# EasyEDA Pro project ProPrj_ESP32-S3-Super Mini_2025-10-25.epro

# Schematic ESP32-S3-Super Mini
Board Name: PCB2; Create Date: 2025-10-25; Page Name: P1; Project Name: SSD1309; Schematic Name: ESP32-S3-Super Mini; Update Date: 2025-10-25; Company: EasyEDA.com; Drawn: EasyEDA; Page Size: A4; Part Number: JLCPCB-002; Reviewed: EasyEDA; Version: V0.1
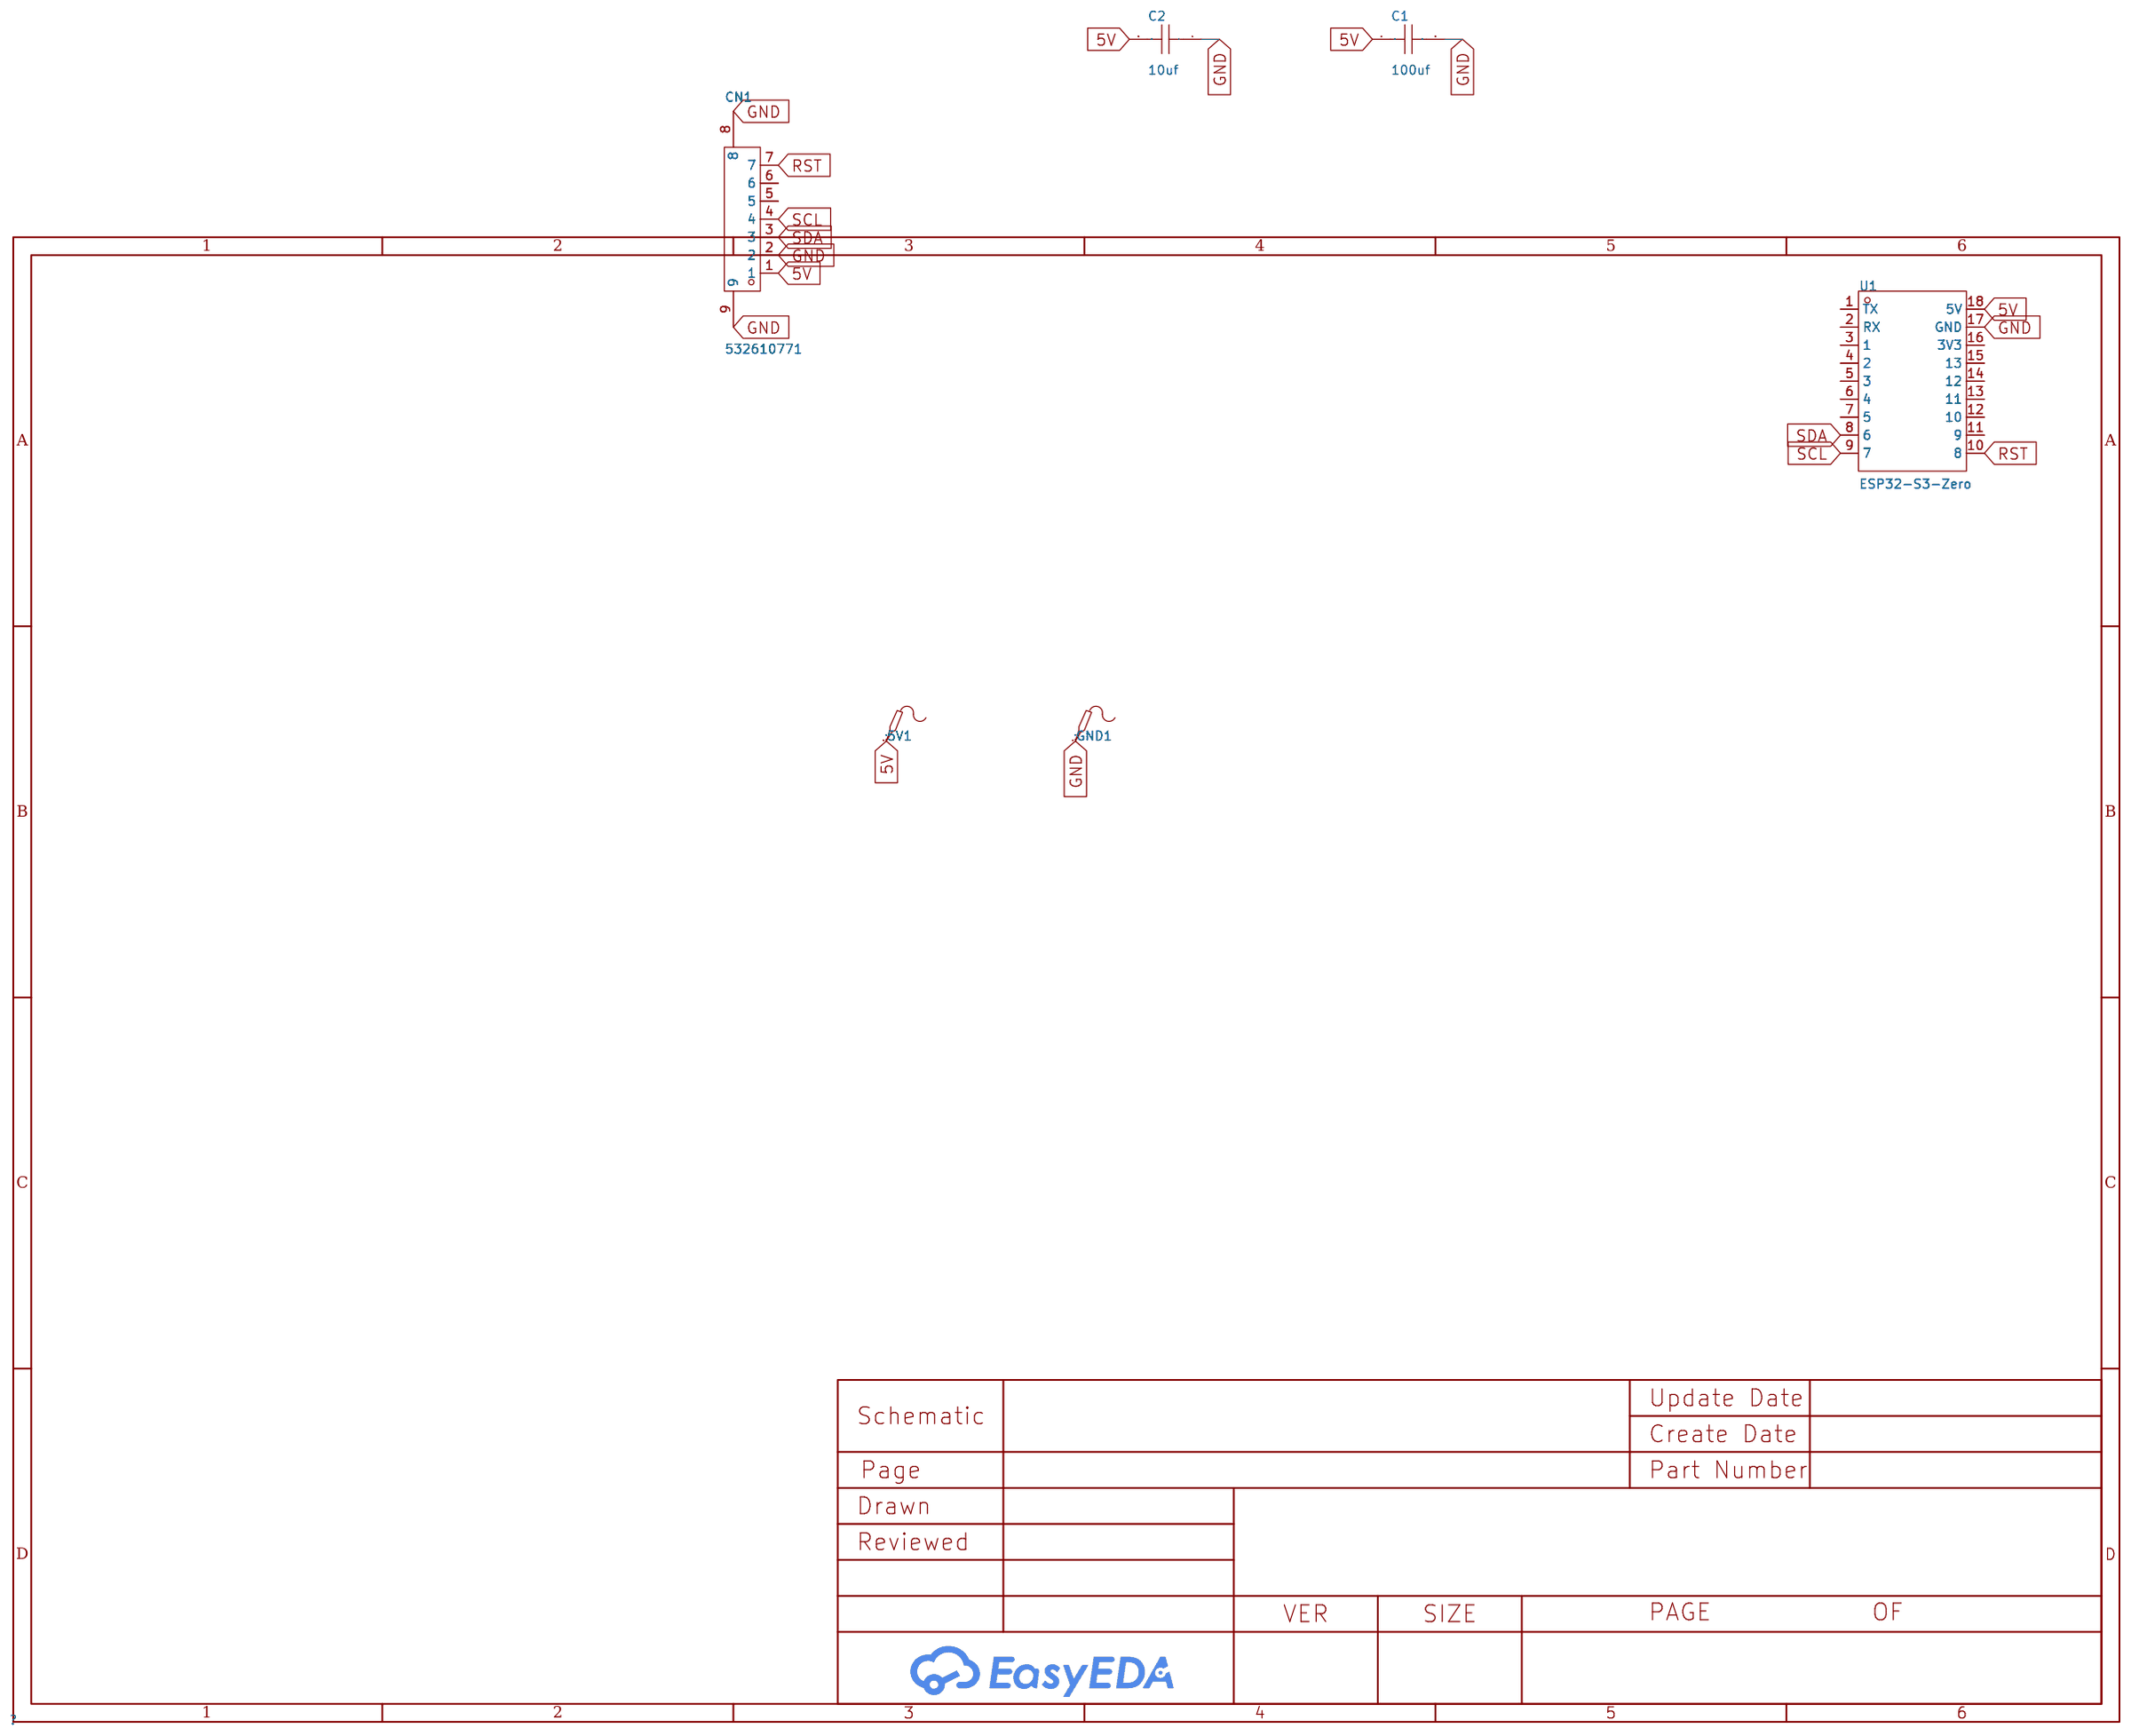
[diagram p0: schematic sheet]

## Parts
5V1  -  [Test-Point-0.5mm]
C1  100uf  [C1206]
C2  10uf  [C0603]
CN1  532610771  [CONN-SMD_532610771]
GND1  -  [Test-Point-0.5mm]
U1  ESP32-S3-Zero  [COMM-SMD_18P-P2.54-L23.5-W18.0-TL]

## Library data of the parts
5V1 GND1 = Test-Point: Test Point 测试点
C1 = C1206: Supplier Part: C9900018280; JLCPCB Part Class: Extended Part; Supplier: LCSC
C2 = CAP_0603: Supplier Footprint: 0603
CN1 = 532610771: Pins Structure:1x7P Pitch:1.25mm Mounting Type:Surface Mount, Right Angle Reference Series:PicoBlade(MX 1.25) Number of Pins:7P Number of Rows:1 Number of PINs Per Row:7 Row Spacing:- Current Rating:1A Contact Material:Phosphor Bronze Contact Plating:Tin; LCSC Part Name: 1x7P 间距:1.25mm 卧贴 系列:PicoBlade(MX 1.25); Supplier Part: C505276; Manufacturer: MOLEX; Supplier Footprint: SMD,P=1.25mm,卧贴; JLCPCB Part Class: Extended Part; Datasheet: https://www.molex.com/content/dam/molex/molex-dot-com/products/automated/en-us/salesdrawingpdf/532/53261/532610771_sd.pdf?inline; Supplier: LCSC; Pins Structure: 1x7P; Pitch: 1.25mm; Mounting Type: Surface Mount, Right Angle; Reference Series: PicoBlade(MX 1.25); Number of Pins: 7P; Number of Rows: 1; Number of PINs Per Row: 7; Current Rating: 1A; Contact Material: Phosphor Bronze; Contact Plating: Tin; Operating Temperature: -40℃~+105℃; Voltage Rating: 125V; Plastic Material: Glass-Fiber Reinforced PA; Flame Retardant Rating: UL94V-0; Supplementary Features: Auxiliary Solder Pin; Color: White; Z-Height of the Board: 3.4mm; X-Length of Bottom Edge on Board (Spacing Line): 13.9mm; Y-Width of Bottom Edge on Board: 5.2mm
U1 = ESP32-S3-Zero: Supplier Part: C9900152785; Supplier Footprint: SMD; Supplier: LCSC

## Nets
5V: 5V1.1 C1.1 C2.2 CN1.1 U1.18(5V)
GND: C1.2 C2.1 CN1.2 CN1.8 CN1.9 GND1.1 U1.17(GND)
RST: CN1.7 U1.10(8)
SCL: CN1.4 U1.9(7)
SDA: CN1.3 U1.8(6)

Not connected (* = marked no-connect by the designer): CN1 5 6; U1 1(TX) 2(RX) 3(1) 4(2) 5(3) 6(4) 7(5) 11(9) 12(10) 13(11) 14(12) 15(13) 16(3V3)

# Schematic ESP32-S3-Zero
Board Name: Board1; Create Date: 2025-10-25; Page Name: P1; Project Name: SSD1309; Schematic Name: Schematic1; Update Date: 2025-10-25; Company: EasyEDA.com; Drawn: EasyEDA; Page Size: A4; Part Number: JLCPCB-002; Reviewed: EasyEDA; Version: V0.1
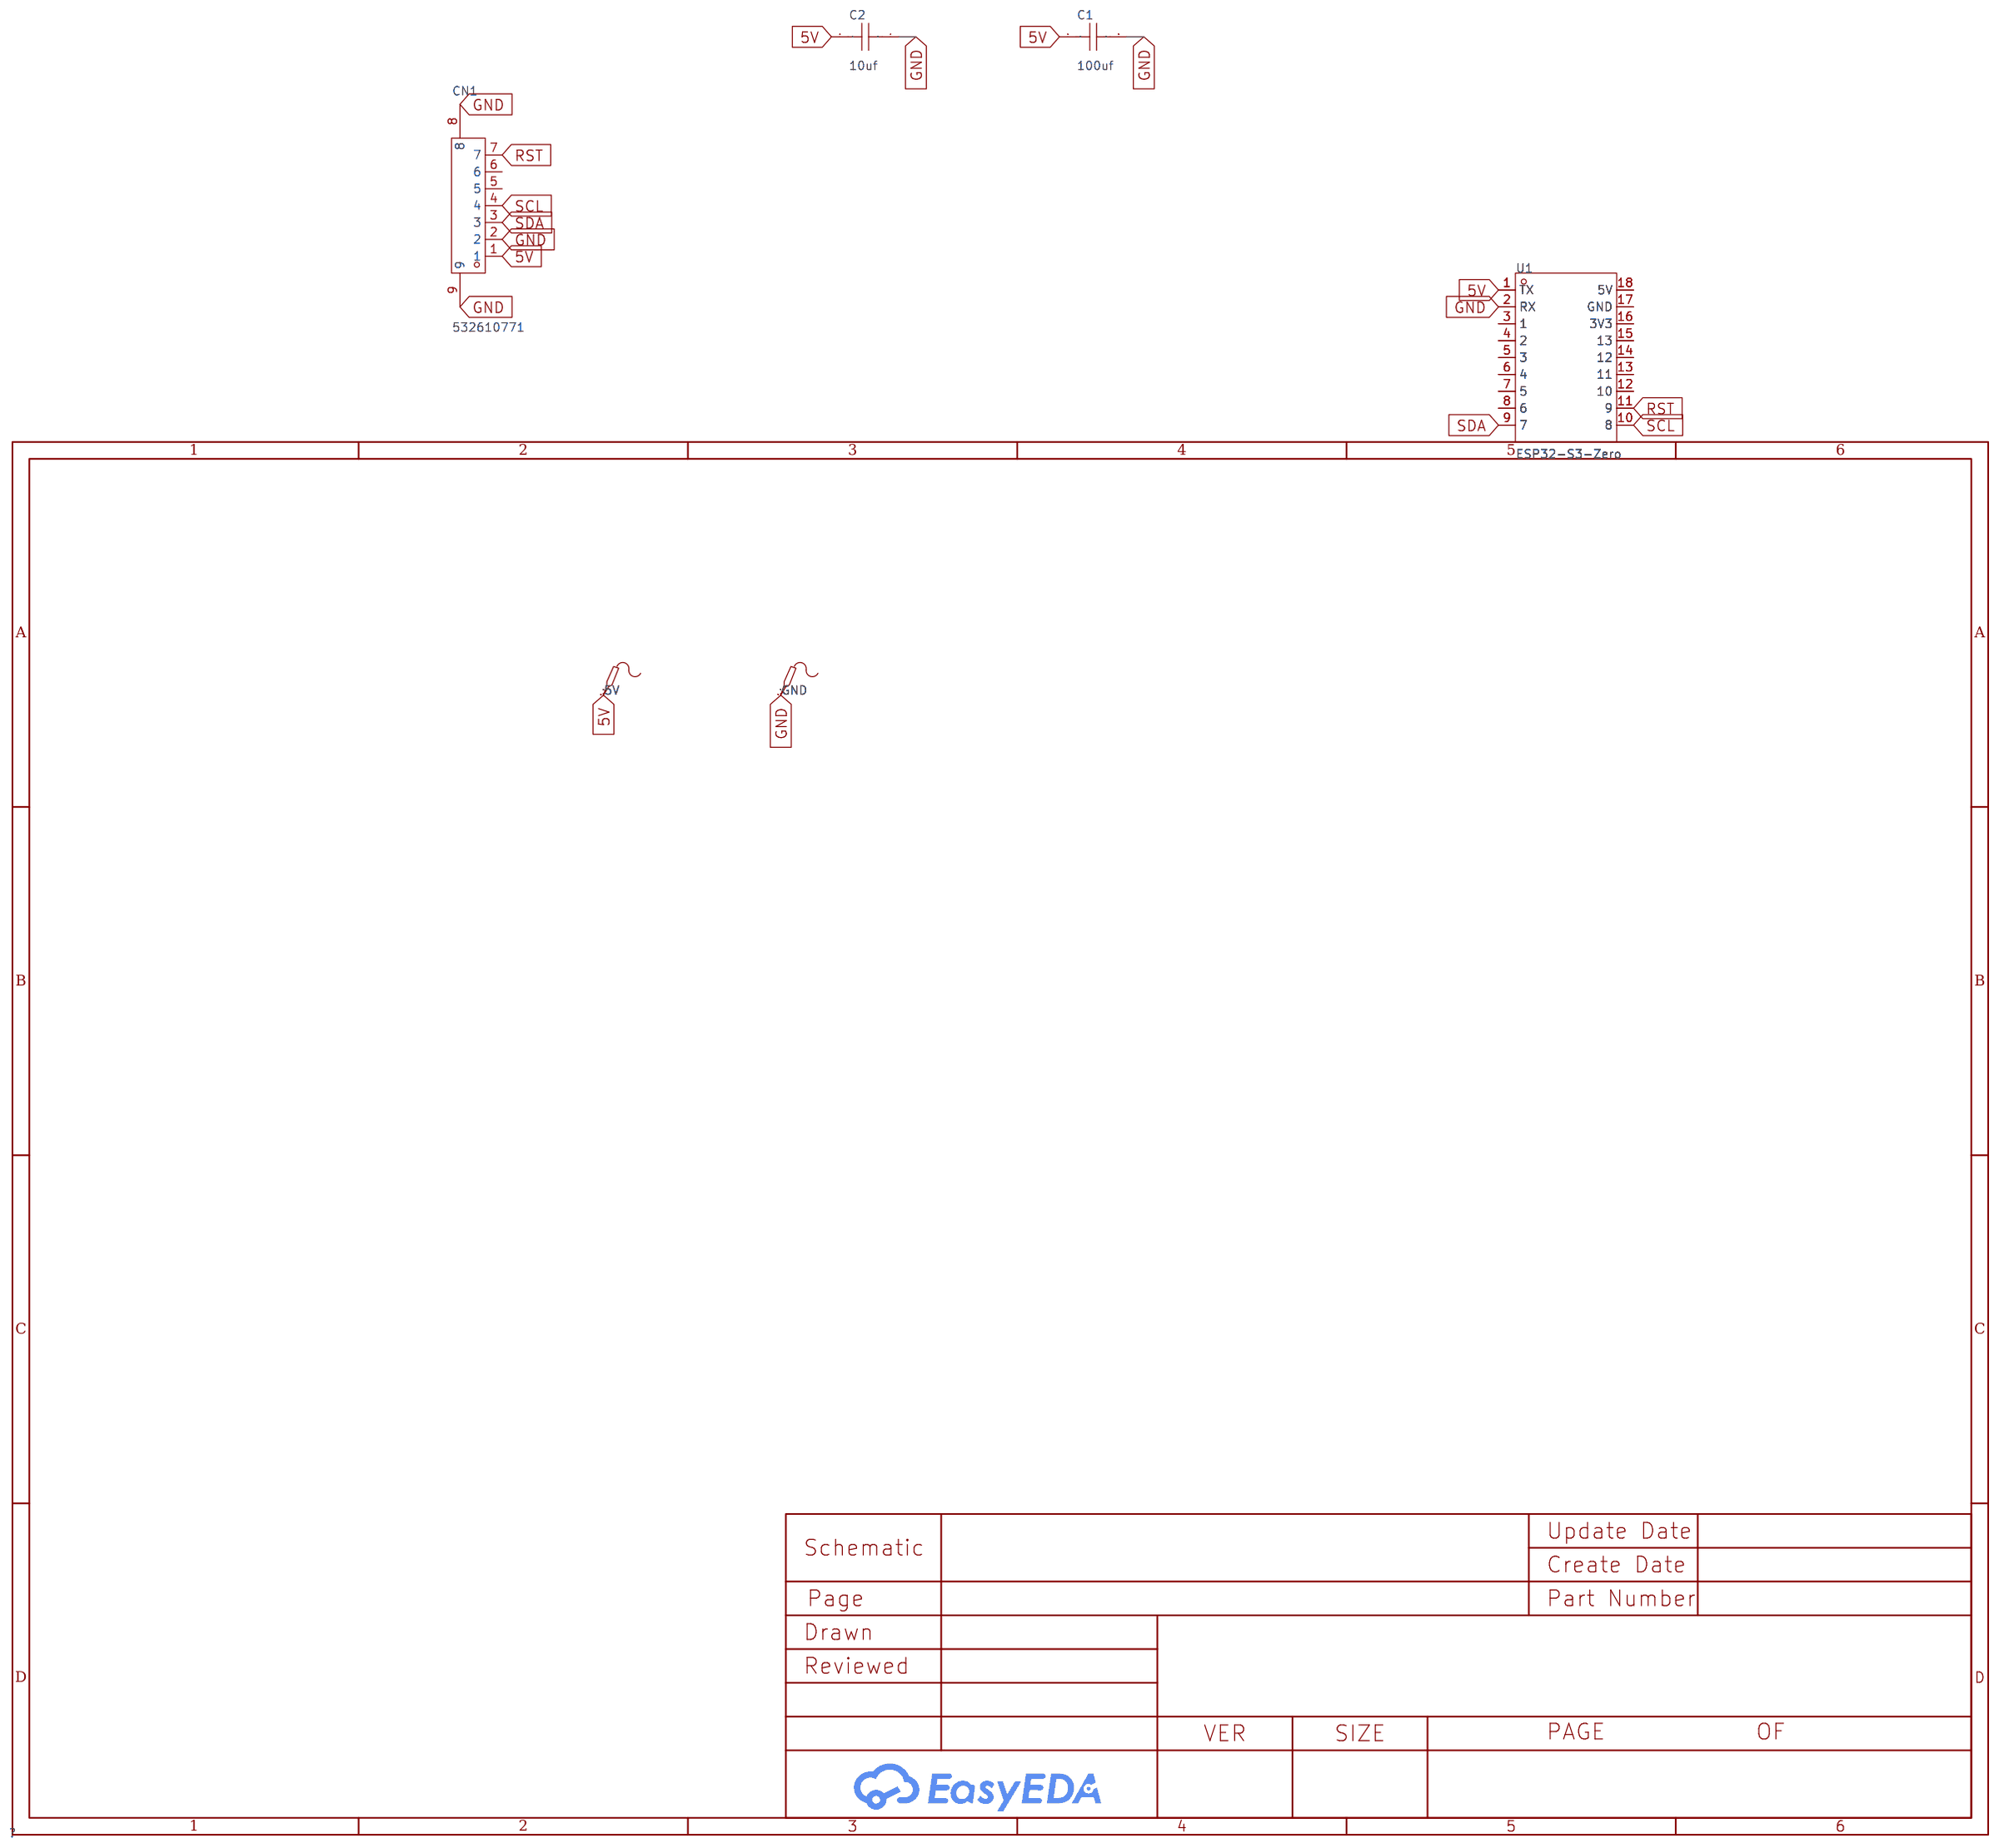
[diagram p1: schematic sheet]

## Parts
5V  -  [Test-Point-0.5mm]
C1  100uf  [C1206]
C2  10uf  [C0603]
CN1  532610771  [CONN-SMD_532610771]
GND  -  [Test-Point-0.5mm]
U1  ESP32-S3-Zero  [COMM-SMD_18P-P2.54-L23.5-W18.0-TL]

## Library data of the parts
5V GND = Test-Point: Test Point 测试点
C1 = C1206: Supplier Part: C9900018280; JLCPCB Part Class: Extended Part; Supplier: LCSC
C2 = CAP_0603: Supplier Footprint: 0603
CN1 = 532610771: Pins Structure:1x7P Pitch:1.25mm Mounting Type:Surface Mount, Right Angle Reference Series:PicoBlade(MX 1.25) Number of Pins:7P Number of Rows:1 Number of PINs Per Row:7 Row Spacing:- Current Rating:1A Contact Material:Phosphor Bronze Contact Plating:Tin; LCSC Part Name: 1x7P 间距:1.25mm 卧贴 系列:PicoBlade(MX 1.25); Supplier Part: C505276; Manufacturer: MOLEX; Supplier Footprint: SMD,P=1.25mm,卧贴; JLCPCB Part Class: Extended Part; Datasheet: https://www.molex.com/content/dam/molex/molex-dot-com/products/automated/en-us/salesdrawingpdf/532/53261/532610771_sd.pdf?inline; Supplier: LCSC; Pins Structure: 1x7P; Pitch: 1.25mm; Mounting Type: Surface Mount, Right Angle; Reference Series: PicoBlade(MX 1.25); Number of Pins: 7P; Number of Rows: 1; Number of PINs Per Row: 7; Current Rating: 1A; Contact Material: Phosphor Bronze; Contact Plating: Tin; Operating Temperature: -40℃~+105℃; Voltage Rating: 125V; Plastic Material: Glass-Fiber Reinforced PA; Flame Retardant Rating: UL94V-0; Supplementary Features: Auxiliary Solder Pin; Color: White; Z-Height of the Board: 3.4mm; X-Length of Bottom Edge on Board (Spacing Line): 13.9mm; Y-Width of Bottom Edge on Board: 5.2mm
U1 = ESP32-S3-Zero: Supplier Part: C9900152785; Supplier Footprint: SMD; Supplier: LCSC

## Nets
5V: 5V.1 C1.1 C2.2 CN1.1 U1.1(TX)
GND: C1.2 C2.1 CN1.2 CN1.8 CN1.9 GND.1 U1.2(RX)
RST: CN1.7 U1.11(9)
SCL: CN1.4 U1.10(8)
SDA: CN1.3 U1.9(7)

Not connected (* = marked no-connect by the designer): CN1 5 6; U1 3(1) 4(2) 5(3) 6(4) 7(5) 8(6) 12(10) 13(11) 14(12) 15(13) 16(3V3) 17(GND) 18(5V)

# Board ESP32-S3-Zero
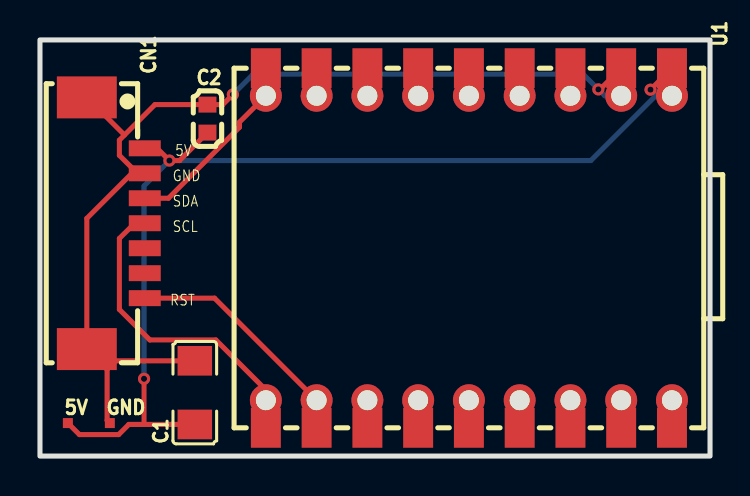
[diagram p2: board, top side]
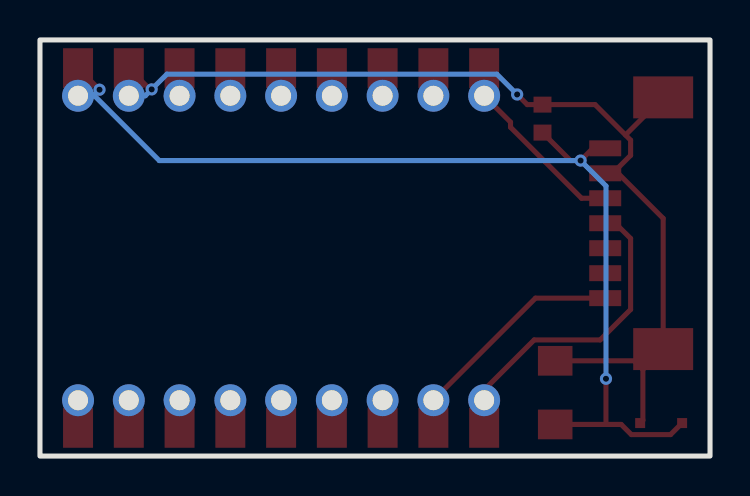
[diagram p3: board, bottom side, seen from below]

Outline 33.53 x 20.83 mm; copper layers: Top Layer, Bottom Layer. Coordinates in mm from the lower left corner of the outline.
Outline path: rectangle 0,20.83 33.53,0
Stack: Top Layer 0.035mm / Dielectric1 1.51mm FR4 er 4.5 / Bottom Layer 0.035mm

## Design rules (mm)
template: JLCPCB Capability(Multiple Layers Board)
spacing copperThickness1oz (default): track to track 0.102, other pairs 0.152 to 0.3
spacing copperThickness2oz: track to track 0.203, other pairs 0.152 to 0.3
spacing copperThicknessInner0.5oz: track to track 0.089, other pairs 0.152 to 0.3
track width copperThickness1oz (default): min 0.102, default 0.254, max 2.54
track width copperThickness0.5oz: min 0.089, default 0.254, max 2.54
track width copperThickness2oz: min 0.203, default 0.254, max 2.54
differential pair differentialPair (default): width min 0.127, default 0.254, max 2.54; gap min 0.152, default 0.152
via viaSize (default): diameter min 0.3, default 0.61, max 10; hole min 0.2, default 0.305, max 6.3

## Placement (name value [footprint] x y rotation side)
5V  -  [Test-Point-0.5mm]  1.4 1.65 0 top
C1  100uf  [C1206]  7.75 3.17 90 top
C2  10uf  [C0603]  8.38 16.89 270 top
CN1  532610771  [CONN-SMD_532610771]  3.79 11.65 270 top
GND  -  [Test-Point-0.5mm]  3.5 1.65 0 top
U1  ESP32-S3-Zero  [COMM-SMD_18P-P2.54-L23.5-W18.0-TL]  21.46 10.41 270 top

## Footprints (pads in the part's own frame, mm; a bottom-side part is the same pattern mirrored in y, then rotated)
C0603
  rect 0.8x0.9 smd: 1(-0.7,0) 2(0.7,0)
C1206
  rect 1.485x1.728 smd: 1(-1.593,0) 2(1.593,0)
COMM-SMD_18P-P2.54-L23.5-W18.0-TL
  rect 2x1.5 smd: 1(-9,10.16) 2(-9,7.62) 3(-9,5.08) 4(-9,2.54) 5(-9,0) 6(-9,-2.54) 7(-9,-5.08) 8(-9,-7.62) 9(-9,-10.16) 10(9,-10.16) 11(9,-7.62) 12(9,-5.08) 13(9,-2.54) 14(9,0) 15(9,2.54) 16(9,5.08) 17(9,7.62) 18(9,10.16)
  round 1.6 hole 1: 1(-7.62,10.16) 2(-7.62,7.62) 3(-7.62,5.08) 4(-7.62,2.54) 5(-7.62,0) 6(-7.62,-2.54) 7(-7.62,-5.08) 8(-7.62,-7.62) 9(-7.62,-10.16) 10(7.62,-10.16) 11(7.62,-7.62) 12(7.62,-5.08) 13(7.62,-2.54) 14(7.62,0) 15(7.62,2.54) 16(7.62,5.08) 17(7.62,7.62) 18(7.62,10.16)
CONN-SMD_532610771
  rect 0.8x1.6 smd: 1(-3.75,1.45) 2(-2.5,1.45) 3(-1.25,1.45) 4(0,1.45) 5(1.25,1.45) 6(2.5,1.45) 7(3.75,1.45)
  rect 2.1x3 smd: 8(6.3,-1.45) 9(-6.3,-1.45)
Test-Point-0.5mm
  rect 0.5x0.5 smd: 1(0,0)

## Nets
As in the schematic.

Pads without a net: CN1 5 6; U1 3 4 5 6 7 8 12 13 14 15 16 17 18

## Via types
v1: diameter 0.61, hole 0.305, Top Layer to Bottom Layer, 5 vias

## Routing (per net, layer and track width the routed paths; a pad name or vN(x,y) marks a point on that pad's centre or on a via; arc(x,y) is an arc through that point)
5V: length 52.9
  Top Layer w0.254: C2.2 6.98,14.79 v1(6.48,14.79) 5.86,15.4 CN1.1 ; v1(30.55,18.34) U1.1 ; 5.21,1.58 4.44,1.58 3.94,1.07 1.97,1.07 5V.1 ; 5.21,1.58 C1.1 ; 5.21,1.58 v1(5.21,3.87)
  Bottom Layer w0.254: 30.8,18.03 30.8,18.09 v1(30.55,18.34) ; 30.8,18.03 27.56,14.79 v1(6.48,14.79) 5.21,13.52 v1(5.21,3.87) ; 30.8,18.03 U1.1
GND: length 52.2
  Top Layer w0.254: 3.36,4.34 3.36,1.79 GND.1 ; 3.36,4.34 2.34,5.35 2.34,11.9 4.74,14.29 ; 3.36,4.34 3.79,4.77 C1.2 ; 5.24,14.15 5.11,14.29 4.74,14.29 ; 4.74,14.29 3.97,15.05 3.97,15.81 5.75,17.59 C2.1 9.14,17.59 v1(9.65,18.1) ; 4.23,16.07 CN1.9 ; U1.2 28.02,18.35 v1(27.94,18.35)
  Bottom Layer w0.254: v1(9.65,18.1) 10.67,19.11 27.18,19.11 v1(27.94,18.35) 28.26,18.03 U1.2
RST: length 12.1
  Top Layer w0.254: CN1.7 8.73,7.9 13.84,2.79 U1.11
SCL: length 16
  Top Layer w0.254: U1.10 11.3,3.31 8.8,5.81 5.5,5.81 3.97,7.34 3.97,10.89 4.74,11.65 CN1.4
SDA: length 9.7
  Top Layer w0.254: CN1.3 6.43,12.9 9.98,16.46 9.98,16.71 U1.9 U1.9

## Text on the board
Top Silkscreen Layer: RST | GND | SDA | SCL | 5V

# Board ESP32-S3-Super Mini
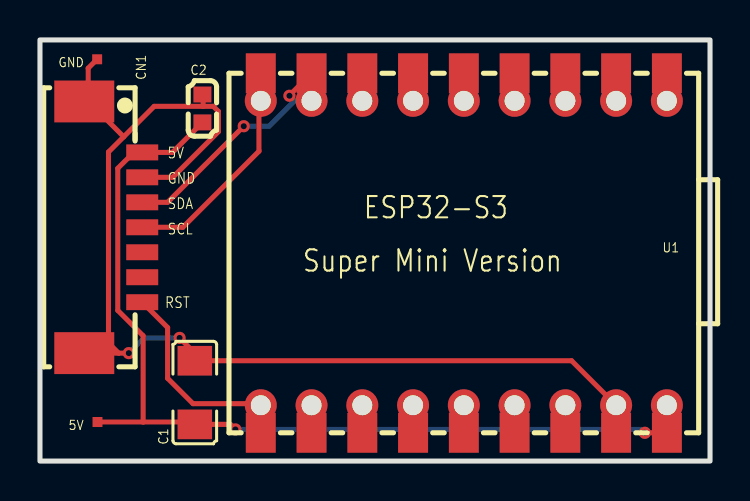
[diagram p4: board, top side]
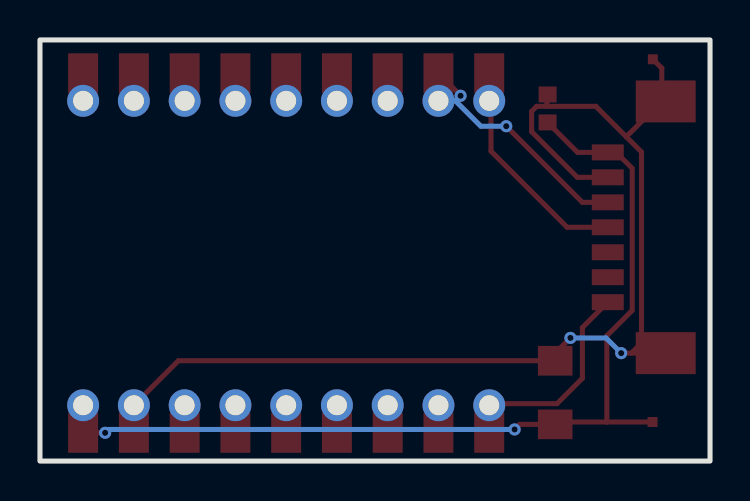
[diagram p5: board, bottom side, seen from below]

Outline 33.53 x 21.08 mm; copper layers: Top Layer, Bottom Layer. Coordinates in mm from the lower left corner of the outline.
Outline path: rectangle 0,21.08 33.53,0
Stack: Top Layer 0.035mm / Dielectric1 1.51mm FR4 er 4.5 / Bottom Layer 0.035mm

## Design rules (mm)
template: JLCPCB Capability(Multiple Layers Board)
spacing copperThickness1oz (default): track to track 0.102, other pairs 0.152 to 0.3
spacing copperThickness2oz: track to track 0.203, other pairs 0.152 to 0.3
spacing copperThicknessInner0.5oz: track to track 0.089, other pairs 0.152 to 0.3
track width copperThickness1oz (default): min 0.102, default 0.254, max 2.54
track width copperThickness0.5oz: min 0.089, default 0.254, max 2.54
track width copperThickness2oz: min 0.203, default 0.254, max 2.54
differential pair differentialPair (default): width min 0.127, default 0.254, max 2.54; gap min 0.152, default 0.152
via viaSize (default): diameter min 0.3, default 0.61, max 10; hole min 0.2, default 0.305, max 6.3

## Placement (name value [footprint] x y rotation side)
5V  -  [Test-Point-0.5mm]  2.88 1.95 0 top
C1  100uf  [C1206]  7.75 3.43 90 top
C2  10uf  [C0603]  8.13 17.65 270 top
CN1  532610771  [CONN-SMD_532610771]  3.67 11.7 270 top
GND  -  [Test-Point-0.5mm]  2.86 20.11 0 top
U1  ESP32-S3-Zero  [COMM-SMD_18P-P2.54-L23.5-W18.0-TL]  21.21 10.41 270 top

## Footprints (pads in the part's own frame, mm; a bottom-side part is the same pattern mirrored in y, then rotated)
C0603
  rect 0.8x0.9 smd: 1(-0.7,0) 2(0.7,0)
C1206
  rect 1.485x1.728 smd: 1(-1.593,0) 2(1.593,0)
COMM-SMD_18P-P2.54-L23.5-W18.0-TL
  rect 2x1.5 smd: 1(-9,10.16) 2(-9,7.62) 3(-9,5.08) 4(-9,2.54) 5(-9,0) 6(-9,-2.54) 7(-9,-5.08) 8(-9,-7.62) 9(-9,-10.16) 10(9,-10.16) 11(9,-7.62) 12(9,-5.08) 13(9,-2.54) 14(9,0) 15(9,2.54) 16(9,5.08) 17(9,7.62) 18(9,10.16)
  round 1.6 hole 1: 1(-7.62,10.16) 2(-7.62,7.62) 3(-7.62,5.08) 4(-7.62,2.54) 5(-7.62,0) 6(-7.62,-2.54) 7(-7.62,-5.08) 8(-7.62,-7.62) 9(-7.62,-10.16) 10(7.62,-10.16) 11(7.62,-7.62) 12(7.62,-5.08) 13(7.62,-2.54) 14(7.62,0) 15(7.62,2.54) 16(7.62,5.08) 17(7.62,7.62) 18(7.62,10.16)
CONN-SMD_532610771
  rect 0.8x1.6 smd: 1(-3.75,1.45) 2(-2.5,1.45) 3(-1.25,1.45) 4(0,1.45) 5(1.25,1.45) 6(2.5,1.45) 7(3.75,1.45)
  rect 2.1x3 smd: 8(6.3,-1.45) 9(-6.3,-1.45)
Test-Point-0.5mm
  rect 0.5x0.5 smd: 1(0,0)

## Nets
5V: 5V.1 C1.1 C2.2 CN1.1 U1.18
GND: C1.2 C2.1 CN1.2 CN1.8 CN1.9 GND.1 U1.17
RST: CN1.7 U1.10
SCL: CN1.4 U1.9
SDA: CN1.3 U1.8

Pads without a net: CN1 5 6; U1 1 2 3 4 5 6 7 11 12 13 14 15 16

## Via types
v1: diameter 0.61, hole 0.305, Top Layer to Bottom Layer, 6 vias

## Routing (per net, layer and track width the routed paths; a pad name or vN(x,y) marks a point on that pad's centre or on a via; arc(x,y) is an arc through that point)
5V: length 48.5
  Top Layer w0.254: C2.2 6.63,15.45 CN1.1 5.08,15.42 4.66,15.42 3.89,14.65 3.89,7.54 5.16,6.27 5.16,1.95 ; 5V.1 5.16,1.95 ; 5.16,1.95 7.63,1.95 C1.1 9.53,1.84 v1(9.78,1.58) ; U1.18 U1.18 v1(30.27,1.41)
  Bottom Layer w0.254: v1(30.27,1.41) 30.1,1.58 v1(9.78,1.58)
GND: length 58.1
  Top Layer w0.254: 4.19,16.23 2.41,18.01 ; 4.19,16.23 5.72,17.76 8.17,17.76 ; 4.19,16.23 3.43,15.47 3.43,5.91 3.94,5.4 ; 2.41,18.01 2.41,19.67 GND.1 ; 2.41,18.01 2.22,18 ; 3.94,5.4 CN1.8 ; 3.94,5.4 v1(4.44,5.4) ; 8.17,17.76 8.17,18.32 C2.1 ; 8.17,17.76 8.67,17.76 8.93,17.5 8.93,16.49 6.64,14.2 CN1.2 ; v1(6.99,6.16) 7.75,5.4 C1.2 26.6,5.02 U1.17 U1.17
  Bottom Layer w0.254: v1(4.44,5.4) 5.21,6.16 v1(6.99,6.16)
RST: length 10.9
  Top Layer w0.254: CN1.7 6.39,6.68 6.39,4.14 7.66,2.87 10.97,2.87 U1.10 U1.10
SCL: length 11.4
  Top Layer w0.254: U1.9 U1.9 10.96,17.94 10.96,15.51 7.15,11.7 CN1.4
SDA: length 12.5
  Top Layer w0.254: CN1.3 6.39,12.95 v1(10.2,16.76) ; U1.8 12.48,18.31 v1(12.48,18.29)
  Bottom Layer w0.254: v1(10.2,16.76) 11.47,16.76 12.74,18.03 ; 12.74,18.03 U1.8 ; 12.74,18.03 v1(12.48,18.29)

## Text on the board
Top Silkscreen Layer: RST | 5V | GND | SDA | SCL | Super Mini Version | ESP32-S3
